# EAGLE design ISS-Notify_Test-Harness (EAGLE 6.4)
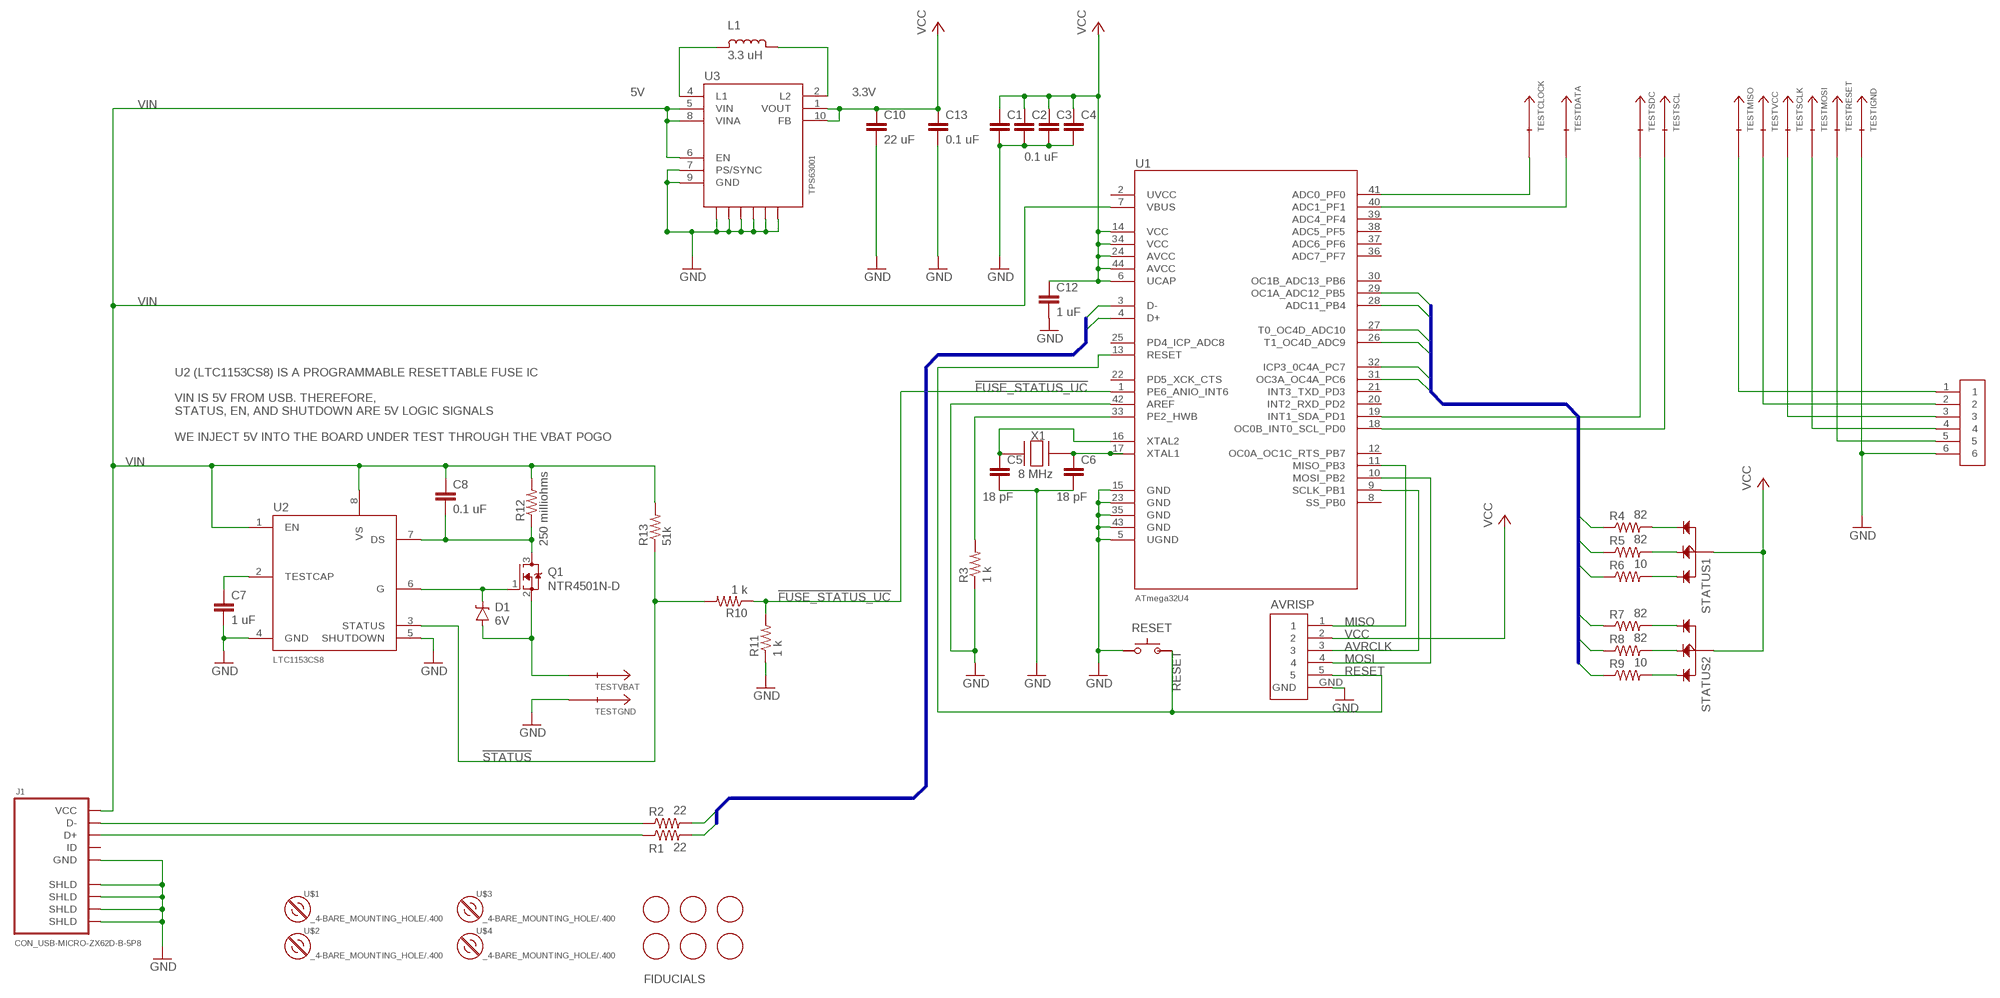
[diagram p0: schematic, sheet 1]

## Parts
AVRISP  AVRISP  [AVRISP]
C1  0.1 uF  C-EU0603-C-NOSILK  [0603-C-NOSILK]
C2  0.1 uF  C-EU0603-C-NOSILK  [0603-C-NOSILK]
C3  0.1 uF  C-EU0603-C-NOSILK  [0603-C-NOSILK]
C4  0.1 uF  C-EU0603-C-NOSILK  [0603-C-NOSILK]
C5  18 pF  C-EU0603-C-NOSILK  [0603-C-NOSILK]
C6  18 pF  C-EU0603-C-NOSILK  [0603-C-NOSILK]
C7  1 uF  C-EU0603-C-NOSILK  [0603-C-NOSILK]
C8  0.1 uF  C-EU0603-C-NOSILK  [0603-C-NOSILK]
C10  22 uF  C-EU0805-C-NOSILK  [0805-C-NOSILK]
C12  1 uF  C-EU0603-C-NOSILK  [0603-C-NOSILK]
C13  0.1 uF  C-EU0603-C-NOSILK  [0603-C-NOSILK]
D1  6V  DIODE-ZENER3.3V  [SOD-323]
F1  FIDUCIAL  [FIDUCIAL_1MM]
F2  FIDUCIAL  [FIDUCIAL_1MM]
F3  FIDUCIAL  [FIDUCIAL_1MM]
F4  FIDUCIAL  [FIDUCIAL_1MM]
F5  FIDUCIAL  [FIDUCIAL_1MM]
F6  FIDUCIAL  [FIDUCIAL_1MM]
J1  CON_USB-MICRO-ZX62D-B-5P8  [USBMICROSMT-HIROSE]
JPROGRAMER  6HEADER  [6HEAD]
L1  3.3 uH  PWR_INDUCTOR  [0805-C-NOSILK]
Q1  NTR4501N-D  [SOT-23]
R1  22  R-US_0603-C-NOSILK  [0603-C-NOSILK]
R2  22  R-US_0603-C-NOSILK  [0603-C-NOSILK]
R3  1 k  R-US_0603-C-NOSILK  [0603-C-NOSILK]
R4  82  R-US_0603-C-NOSILK  [0603-C-NOSILK]
R5  82  R-US_0603-C-NOSILK  [0603-C-NOSILK]
R6  10  R-US_0603-C-NOSILK  [0603-C-NOSILK]
R7  82  R-US_0603-C-NOSILK  [0603-C-NOSILK]
R8  82  R-US_0603-C-NOSILK  [0603-C-NOSILK]
R9  10  R-US_0603-C-NOSILK  [0603-C-NOSILK]
R10  1 k  R-US_0603-C-NOSILK  [0603-C-NOSILK]
R11  1 k  R-US_0603-C-NOSILK  [0603-C-NOSILK]
R12  250 milliohms  R-US_0603-C-NOSILK  [0603-C-NOSILK]
R13  51k  R-US_0603-C-NOSILK  [0603-C-NOSILK]
RESET  SWITCH  [SWITCH]
STATUS1  RGBLED  [SMDRGBLED]
STATUS2  RGBLED  [SMDRGBLED]
TESTCLOCK  POGOPIN  [POGOPIN]
TESTDATA  POGOPIN  [POGOPIN]
TESTGND  POGOPIN  [POGOPIN]
TESTIGND  POGOPIN  [POGOPIN]
TESTMISO  POGOPIN  [POGOPIN]
TESTMOSI  POGOPIN  [POGOPIN]
TESTRESET  POGOPIN  [POGOPIN]
TESTSCL  POGOPIN  [POGOPIN]
TESTSCLK  POGOPIN  [POGOPIN]
TESTSDC  POGOPIN  [POGOPIN]
TESTVBAT  POGOPIN  [POGOPIN]
TESTVCC  POGOPIN  [POGOPIN]
U1  ATMEGA32U4  [TQFP-44]
U2  LTC1153CS8  [SO-8]
U3  TPS63001  [QFN10]
U$1  _4-BARE_MOUNTING_HOLE/.400  [_4/.400-BARE+STD_TOOL_CLEARANCE]
U$2  _4-BARE_MOUNTING_HOLE/.400  [_4/.400-BARE+STD_TOOL_CLEARANCE]
U$3  _4-BARE_MOUNTING_HOLE/.400  [_4/.400-BARE+STD_TOOL_CLEARANCE]
U$4  _4-BARE_MOUNTING_HOLE/.400  [_4/.400-BARE+STD_TOOL_CLEARANCE]
X1  8 MHz  CX5Z  [CX5Z]

## Nets
!FUSE_STATUS_UC: R10.1 R11.2 U1.1(PE6_ANIO_INT6)
!STATUS: R10.2 R13.1 U2.3(STATUS)
AVRCLK: AVRISP.3 U1.9(SCLK_PB1)
D+: R1.2 U1.4(D+)
D-: R2.2 U1.3(D-)
GND: AVRISP.GND C1.2 C2.2 C3.2 C4.2 C5.2 C6.2 C7.2 C10.2 C12.2 C13.2 J1.P5(GND) J1.P$1(SHLD) J1.P$2(SHLD) J1.P$3(SHLD) J1.P$4(SHLD) JPROGRAMER.6 R3.1 R11.1 RESET.3 TESTGND.1(TEST) TESTIGND.1(TEST) U1.5(UGND) U1.15(GND) U1.23(GND) U1.35(GND) U1.42(AREF) U1.43(GND) U2.4(GND) U2.5(SHUTDOWN) U3.3(PGND) U3.7(PS/SYNC) U3.9(GND) U3.PAD(GNDPAD) U3.PGND1 U3.PGND2 U3.PGND3 U3.PGND4
LED1_B: R6.1 U1.29(OC1A_ADC12_PB5)
LED1_G: R5.1 U1.32(ICP3_0C4A_PC7)
LED1_R: R4.1 U1.31(OC3A_OC4A_PC6)
LED2_B: R9.1 U1.26(T1_OC4D_ADC9)
LED2_G: R8.1 U1.28(ADC11_PB4)
LED2_R: R7.1 U1.27(T0_OC4D_ADC10)
LED_CLK: TESTCLOCK.1(TEST) U1.41(ADC0_PF0)
LED_DATA: TESTDATA.1(TEST) U1.40(ADC1_PF1)
MISO: AVRISP.1 U1.11(MISO_PB3)
MOSI: AVRISP.4 U1.10(MOSI_PB2)
N$1: L1.1(A) U3.4(L1)
N$2: L1.2(C) U3.2(L2)
N$3: R4.2 STATUS1.RED(R)
N$4: J1.P3(D+) R1.1
N$5: J1.P2(D-) R2.1
N$6: C5.1 U1.16(XTAL2) X1.1
N$7: R5.2 STATUS1.GREEN(G)
N$8: R6.2 STATUS1.BLUE(B)
N$9: R7.2 STATUS2.RED(R)
N$10: C6.1 U1.17(XTAL1) X1.3
N$11: R8.2 STATUS2.GREEN(G)
N$12: R9.2 STATUS2.BLUE(B)
N$13: C7.1 U2.2(TESTCAP)
N$16: C8.2 Q1.3(D) R12.1 U2.7(DS)
N$18: D1.C Q1.1(G) U2.6(G)
N$19: D1.A Q1.2(S) TESTVBAT.1(TEST)
N$42: R3.2 U1.33(PE2_HWB)
RESET: AVRISP.5 RESET.1 U1.13(RESET)
SCL: TESTSCL.1(TEST) U1.18(OC0B_INT0_SCL_PD0)
SDA: TESTSDC.1(TEST) U1.19(INT1_SDA_PD1)
TESTMISO: JPROGRAMER.1 TESTMISO.1(TEST)
TESTMOSI: JPROGRAMER.4 TESTMOSI.1(TEST)
TESTRESET: JPROGRAMER.5 TESTRESET.1(TEST)
TESTSCLK: JPROGRAMER.3 TESTSCLK.1(TEST)
TESTVCC: JPROGRAMER.2 TESTVCC.1(TEST)
VCC: AVRISP.2 C1.1 C2.1 C3.1 C4.1 C10.1 C12.1 C13.1 STATUS1.ANODE STATUS2.ANODE U1.6(UCAP) U1.14(VCC) U1.24(AVCC) U1.34(VCC) U1.44(AVCC) U3.1(VOUT) U3.10(FB)
VIN: C8.1 J1.P1(VCC) R12.2 R13.2 U1.7(VBUS) U2.1(EN) U2.8(VS) U3.5(VIN) U3.6(EN) U3.8(VINA)
Unconnected: J1.P4(ID) U1.8(SS_PB0) U1.12(OC0A_OC1C_RTS_PB7) U1.20(INT2_RXD_PD2) U1.21(INT3_TXD_PD3) U1.22(PD5_XCK_CTS) U1.25(PD4_ICP_ADC8) U1.30(OC1B_ADC13_PB6) U1.36(ADC7_PF7) U1.37(ADC6_PF6) U1.38(ADC5_PF5) U1.39(ADC4_PF4)

## Buses
D+,D-
LED1_R,LED1_G,LED1_B,LED2_R,LED2_G,LED2_B

## Notes on the sheet
- 5V | 3.3V
- U2 (LTC1153CS8) IS A PROGRAMMABLE RESETTABLE FUSE IC
  
  VIN IS 5V FROM USB. THEREFORE, 
  STATUS, EN, AND SHUTDOWN ARE 5V LOGIC SIGNALS
  
  WE INJECT 5V INTO THE BOARD UNDER TEST THROUGH THE VBAT POGO
- FIDUCIALS

## Power pins joined to a net without a drawn wire
UVCC: U1.2(UVCC)

## Library data of the parts
AVRISP = ISS-Notify:AVRISP: ISP header for AVR
C1-C8 C10 C12 C13 = rcl_custom:C-EU: CAPACITOR, European symbol
D1 = SparkFun-DiscreteSemi:DIODE-ZENER: Zener Diode Production Part - 8199 3.4V Zener Voltage; PROD_ID: DIO-11284; VALUE: 3.3V
F1-F6 = ISS-Notify:FIDUCIAL
J1 = ISS-Notify:CON_USB-MICRO-ZX62D-B-5P8
JPROGRAMER = ISS-Notify:6HEADER
L1 = ISS-Notify:PWR_INDUCTOR: 3.3 uH Inductor AIML-0805-3R3K-T
Q1 = max-viz:NTR4501N-D
R1-R13 = rcl_custom:R-US_: RESISTOR, American symbol
RESET = ISS-Notify:SWITCH: Tall micro push button
STATUS1 STATUS2 = ISS-Notify:RGBLED
TESTCLOCK TESTDATA TESTGND TESTIGND TESTMISO TESTMOSI TESTRESET TESTSCL TESTSCLK TESTSDC TESTVBAT TESTVCC = ISS-Notify:POGOPIN
U1 = ISS-Notify:ATMEGA32U4: ATMega32U4 AVR embedded microcontroller with USB, UART, SPI, I2C, 32K program space, 1K eeprom, 2.5 K sram
U2 = ISS-Notify:LTC1153CS8
U3 = ISS-Notify:TPS63001: High efficiency buck boost SPS
U$1-U$4 = ISS-Notify:_4-BARE_MOUNTING_HOLE: 1/8" drill hole for #4 screw mount
X1 = ISS-Notify:CX5Z: 8 MHz Crystal

## Board
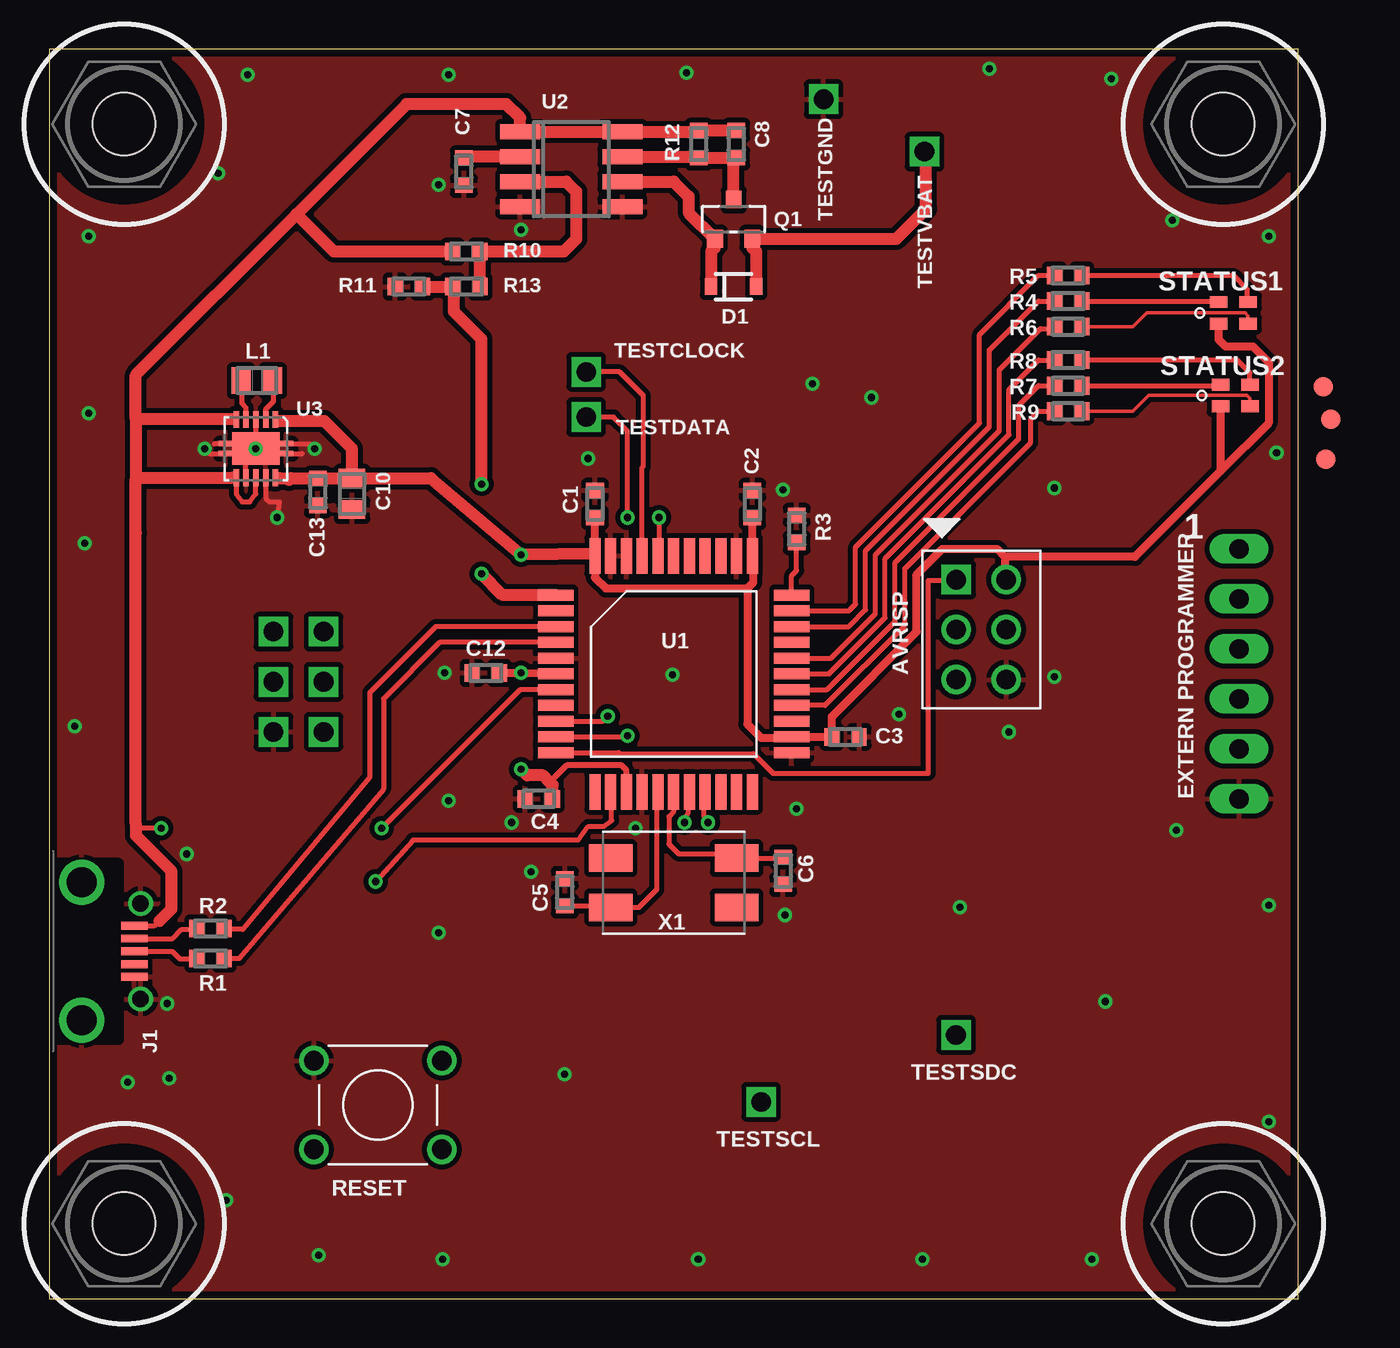
[diagram p1: board, top side]
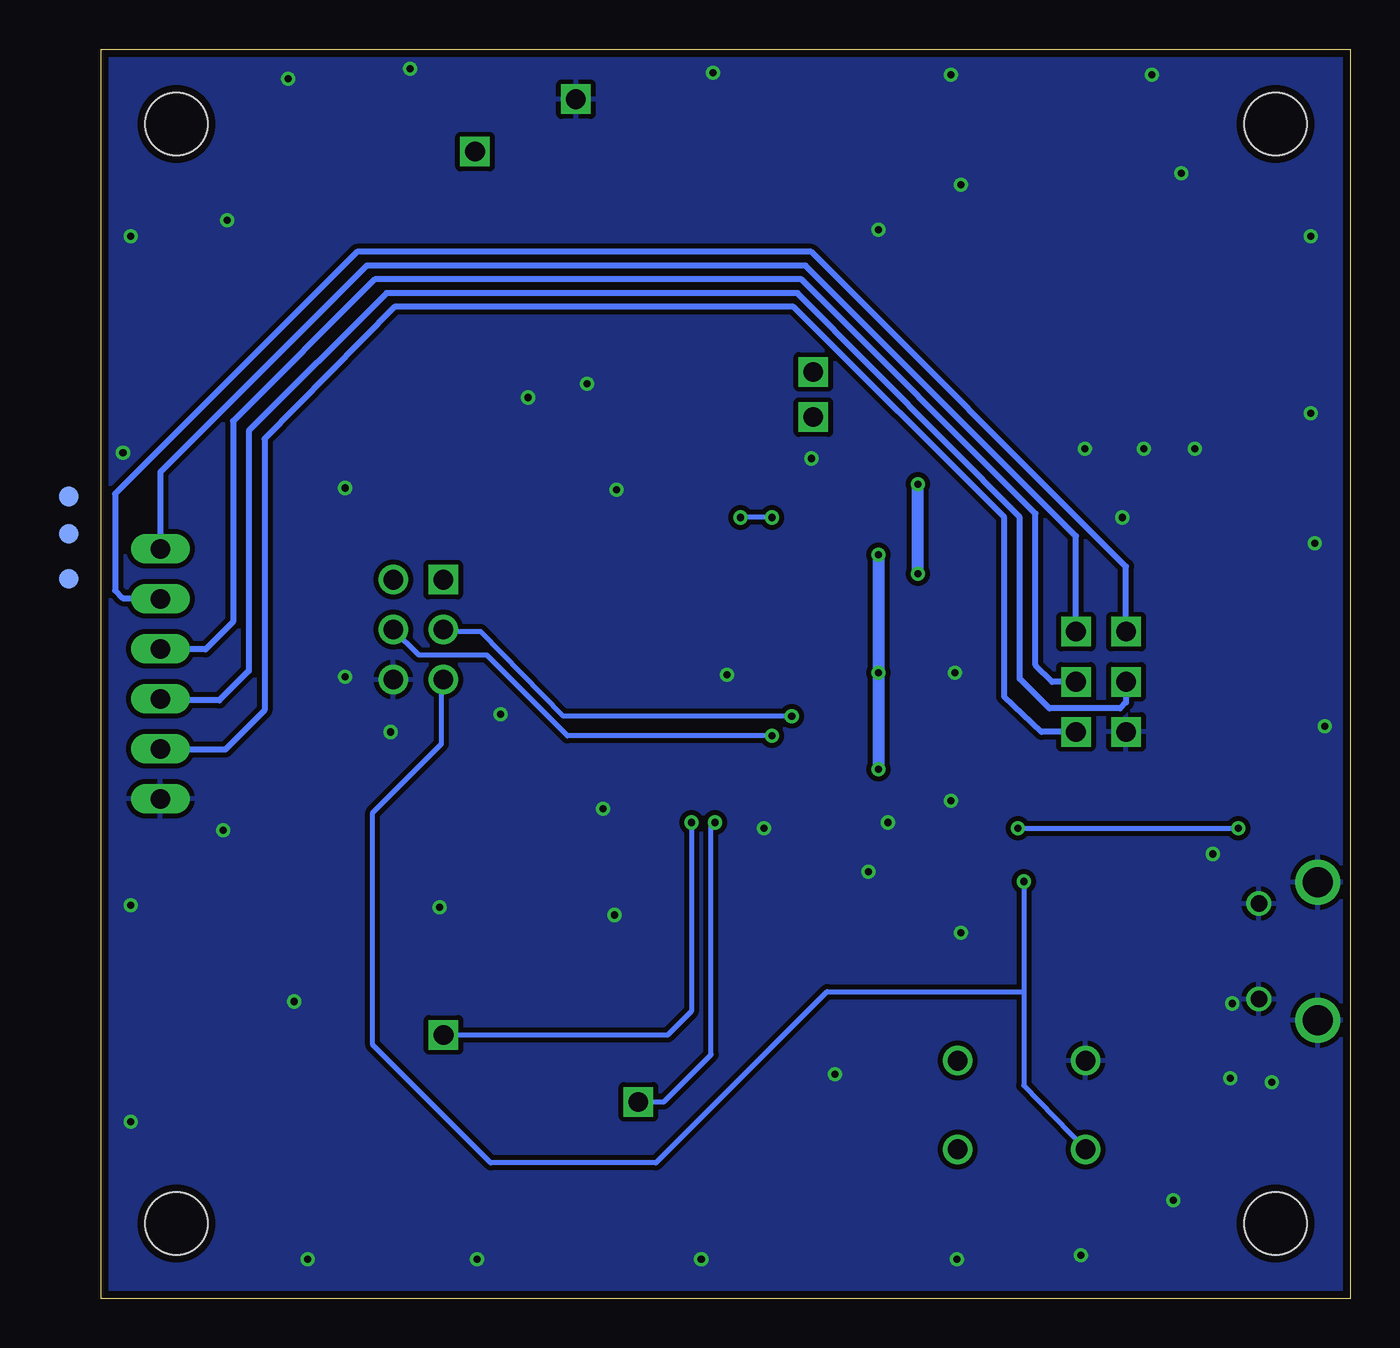
[diagram p2: board, bottom side, seen from below]

Size 63.5 x 63.5 mm. Coordinates in mm from the lower left corner, seen from the top.
Outline: 0,0 63.5,0 63.5,63.5 0,63.5 0,0
Copper layers (1*16): Top 0.0356mm / dielectric 1.5011mm / Bottom 0.0356mm
Design rules "LaenPCBOrder": minimum track width 6mil, minimum drill 13mil, track to track 6mil, track to pad 6mil, pad to pad 6mil, via to via 6mil, smd to smd 6mil, copper to edge 15mil, drill to drill 6mil, minimum pad ring 7mil, minimum via ring 7mil, stop-mask expansion 4mil, vias tented up to drill 0mil, thermal gap 10mil

### Footprints (pad centres in the part's own frame; a part is rotated, then mirrored left to right if it is on the bottom)
AVRISP = drill 1 square: 1 -1.27,2.54 | drill 1: 2 1.27,2.54; 3 -1.27,0; 4 1.27,0; 5 -1.27,-2.54; GND 1.27,-2.54
0603-C-NOSILK = smd 0.75 x 0.9: 1 -0.7,0; 2 0.7,0
0805-C-NOSILK = smd 0.95 x 1.35: 1 -0.8,0; 2 0.8,0
SOD-323 = smd 0.63 x 0.83: A 1.15,0; C -1.15,0
FIDUCIAL_1MM = smd 1 x 1: 1 0,0
USBMICROSMT-HIROSE = smd 0.4 x 1.35: P1 -1.046,2.675; P2 -0.396,2.675; P3 0.254,2.675; P4 0.904,2.675; P5 1.554,2.675 | drill 1.524: P$1 3.764,0; P$2 -3.256,0 | drill 0.838: P$3 -2.171,3; P$4 2.679,3
6HEAD = drill 1 long: 1 0,6.35; 2 0,3.81; 3 0,1.27; 4 0,-1.27; 5 0,-3.81; 6 0,-6.35
SOT-23 = smd 0.8 x 0.9: 1 -0.95,-1; 2 0.95,-1; 3 0,1
SWITCH = drill 1: 1 -3.25,-2.25; 2 3.25,-2.25; 3 -3.25,2.25; 4 3.25,2.25
SMDRGBLED = smd 0.9 x 0.6: ANODE -0.75,-0.55; BLUE 0.75,-0.55; GREEN 0.75,0.55; RED -0.75,0.55
POGOPIN = drill 1 square: 1 0,0
TQFP-44 = smd 1.8 x 0.56: 1 -6,4; 2 -6,3.2; 3 -6,2.4; 4 -6,1.6; 5 -6,0.8; 6 -6,0; 7 -6,-0.8; 8 -6,-1.6; 9 -6,-2.4; 10 -6,-3.2; 11 -6,-4; 23 6,-4; 24 6,-3.2; 25 6,-2.4; 26 6,-1.6; 27 6,-0.8; 28 6,0; 29 6,0.8; 30 6,1.6; 31 6,2.4; 32 6,3.2; 33 6,4 | smd 0.56 x 1.8: 12 -4,-6; 13 -3.2,-6; 14 -2.4,-6; 15 -1.6,-6; 16 -0.8,-6; 17 0,-6; 18 0.8,-6; 19 1.6,-6; 20 2.4,-6; 21 3.2,-6; 22 4,-6; 34 4,6; 35 3.2,6; 36 2.4,6; 37 1.6,6; 38 0.8,6; 39 0,6; 40 -0.8,6; 41 -1.6,6; 42 -2.4,6; 43 -3.2,6; 44 -4,6
SO-8 = smd 0.762 x 2.032: 1 -1.905,-2.727; 2 -0.635,-2.727; 3 0.635,-2.727; 4 1.905,-2.727; 5 1.905,2.473; 6 0.635,2.473; 7 -0.635,2.473; 8 -1.905,2.473
QFN10 = smd 0.28 x 0.85: 1 -1,-1.475; 2 -0.5,-1.475; 3 0,-1.475; 4 0.5,-1.475; 5 1,-1.475; 6 1,1.475; 7 0.5,1.475; 8 0,1.475; 9 -0.5,1.475; 10 -1,1.475 | smd 2.4 x 1.65: PAD 0,0 | smd 0.7 x 0.28: PGND1 1.55,0.25; PGND2 -1.55,0.25; PGND3 -1.55,-0.25; PGND4 1.55,-0.25
_4/.400-BARE+STD_TOOL_CLEARANCE = hole 3.175: 0,0
CX5Z = smd 2.2 x 1.4: 1 -3.2,-1.25; 2 3.2,-1.25; 3 3.2,1.25; 4 -3.2,1.25

### Placement (x,y rotation side)
AVRISP  47.38,34 0 top
C1  27.75,40.39 90 top
C2  35.75,40.39 90 top
C3  40.49,28.55 0 top
C4  24.89,25.4 180 top
C5  26.22,20.66 90 top
C6  37.32,21.74 270 top
C7  21.08,57.28 270 top
C8  34.92,58.67 270 top
C10  15.4,40.9 270 top
C12  22.2,31.8 180 top
C13  13.66,41 270 top
D1  34.8,51.44 0 top
F1  64.77,46.35 0 top
F2  65.15,44.7 0 top
F3  64.9,42.67 0 top
F4  65.15,40.77 0 bottom
F5  65.15,38.86 0 bottom
F6  65.15,36.58 0 bottom
J1  1.65,17.91 270 top
JPROGRAMER  60.5,31.75 0 top
L1  10.56,46.66 0 top
Q1  34.8,54.86 0 top
R1  8.2,17.29 0 top
R2  8.2,18.82 0 top
R3  38,39.12 270 top
R4  51.8,50.7 0 top
R5  51.8,52 0 top
R6  51.8,49.4 0 top
R7  51.8,46.4 0 top
R8  51.8,47.7 0 top
R9  51.8,45.1 0 top
R10  21.21,51.44 0 top
R11  18.29,51.44 0 top
R12  33.02,58.67 90 top
R13  21.21,53.21 180 top
RESET  16.71,9.84 0 top
STATUS1  60.2,50.1 0 top
STATUS2  60.3,45.9 0 top
TESTCLOCK  27.3,47.1 0 top
TESTDATA  27.3,44.8 0 top
TESTGND  39.37,60.96 0 top
TESTIGND  11.4,28.8 0 top
TESTMISO  13.95,33.9 0 top
TESTMOSI  11.4,31.35 0 top
TESTRESET  13.95,28.8 0 top
TESTSCL  36.2,10 0 top
TESTSCLK  13.95,31.35 0 top
TESTSDC  46.1,13.4 0 top
TESTVBAT  44.5,58.3 0 top
TESTVCC  11.4,33.9 0 top
U1  31.75,31.75 0 top
U2  26.67,57.4 270 top
U3  10.51,43.2 180 top
U$1  3.81,59.69 0 top
U$2  59.69,59.69 0 top
U$3  59.69,3.81 0 top
U$4  3.81,3.81 0 top
X1  31.75,21.14 0 top

### Tracks (layer width: path | path; a pad name or v marks a point on that pad's centre or on a via)
!FUSE_STATUS_UC  (via drill 0.36 pad 0.71)
  Top 0.61: R11.2 R10.1 20.57,51.37 20.57,50.16 21.97,48.77 v21.97,41.4 | U1.1 23.05,35.75 v21.97,36.83
  Bottom 0.61: v21.97,36.83 v21.97,41.4
!STATUS
  Top 0.61: U2.3 26.29,56.77 26.8,56.26 26.8,53.85 26.16,53.21 R13.1 R10.2
AVRCLK  (via drill 0.36)
  Top 0.254: 25.7,29.4 U1.9 28.15,29.35 v28.4,29.6
  Bottom 0.254: v28.4,29.6 40,29.6 44.2,33.9 46.01,33.9 AVRISP.3
D+
  Top 0.254: R1.2 9.66,17.29 17,25.9 17,30.5 19.85,33.35 U1.4
D-
  Top 0.254: 8.84,18.87 R2.2 8.94,18.77 9.84,18.77 16.3,26.5 16.3,30.8 19.65,34.15 U1.3
GND  (via drill 0.36)
  Top 0.254: 8.92,43.44 8.39,43.44 | 12.04,43.44 13.26,43.44 v13.5,43.2 | 12.11,42.95 12.87,42.95 | U3.3 U3.PAD 10.4,43.2 10,42.8 U3.7 | v7.9,43.2 8.15,42.95 U3.PGND1 | U3.9 11.01,40.69 11.2,40.5 11.7,40.5 v11.6,39.7
  Top 0.33: U3.PGND4 8.92,43.45 8.92,43.44 | 12.04,43.44 U3.PGND3
  other vias: 6,15 4,11 13.7,2.2 20,2 33,2 53,2 44.4,2 37.4,19.5 24.5,21.7 23.5,24.2 31.7,31.7 38,24.9 27.4,42.7 37.3,41.1 7,22.6 6.1,11.2 57.1,54.8 10.5,43.2 2,45 2,54 54,62 62,54 62.4,43 57.3,23.8 62,20 62,9 9,5 1.8,38.4 1.3,29.1 8.6,57.2 10.1,62.2 20.3,62.2 32.4,62.3 47.8,62.5 20.1,31.8 20.3,25.3 26.2,11.4 46.3,19.9 41.8,45.8 51.1,31.6 48.8,28.8 38.8,46.5 29.8,23.9 43.2,29.7 51.1,41.2 53.7,15.1 19.8,18.6 23.98,54.33 19.79,56.61
  pour Top (isolate 0.254): 0,0 0,63.5 63.5,63.5 63.5,0
  pour Bottom (isolate 0.254): 0,0 0,63.5 63.5,63.5 63.5,0
LED1_B
  Top 0.254: U1.29 39.75,32.55 42,34.8 42,37.8 48.3,44.1 48.3,47.2 50.4,49.3 51,49.3 R6.1
LED1_G
  Top 0.254: U1.32 40.65,34.95 41,35.3 41,38.2 47.3,44.5 47.3,49 50.3,52 R5.1
LED1_R
  Top 0.254: U1.31 40.65,34.15 41.5,35 41.5,38 47.8,44.3 47.8,48.2 50.3,50.7 R4.1
LED2_B
  Top 0.254: R9.1 50.3,45.1 49.9,44.7 49.9,43.5 43.5,37.1 43.5,34.2 39.45,30.15 U1.26
LED2_G
  Top 0.254: U1.28 39.65,31.75 42.5,34.6 42.5,37.6 48.8,43.9 48.8,46.2 50.3,47.7 R8.1
LED2_R
  Top 0.254: R7.1 50.3,46.4 49.3,45.4 49.3,43.7 43,37.4 43,34.4 39.55,30.95 U1.27
LED_CLK
  Top 0.254: U1.41 30.15,42.25 30.2,42.3 30.2,45.9 29,47.1 TESTCLOCK.1
LED_DATA  (via drill 0.36)
  Top 0.254: v31,39.7 31,37.8 | v29.4,39.7 29.4,44.1 28.7,44.8 TESTDATA.1
  Top 0.305: 31,37.8 U1.40
  Bottom 0.254: v29.4,39.7 v31,39.7
MISO
  Top 0.254: U1.11 28.95,27.75 29,27.7 35.8,27.7 36.8,26.7 44.7,26.7 44.7,36.5 46.07,36.5 AVRISP.1
MOSI  (via drill 0.36)
  Top 0.254: U1.10 29.35,28.55 v29.4,28.6
  Bottom 0.254: v29.4,28.6 39.8,28.6 43.9,32.7 47.35,32.7 AVRISP.4
N$1
  Top 0.254: U3.4 10.01,45.29 9.8,45.5 9.8,46.72 L1.1
N$2
  Top 0.254: U3.2 11.01,45.21 11.4,45.6 11.4,46.72 L1.2
N$3
  Top 0.254: R4.2 59.4,50.7 STATUS1.RED
N$4
  Top 0.254: R1.1 7.48,17.27 6.64,17.27 6.26,17.65 J1.P3
N$5
  Top 0.254: R2.1 7.46,18.77 6.74,18.77 6.27,18.3 J1.P2
N$6
  Top 0.254: C5.1 28.38,19.96 X1.1 29.99,19.89 30.9,20.8 30.9,25.7 U1.16
N$7
  Top 0.254: R5.2 60.2,52 60.9,51.3 60.9,50.7 STATUS1.GREEN
N$8
  Top 0.178: STATUS1.BLUE 60.95,49.95 60.8,50.1 55.8,50.1 55.1,49.4 R6.2
N$9
  Top 0.254: R7.2 59.5,46.4 STATUS2.RED
N$10
  Top 0.254: U1.17 31.75,24.75 31.5,24.5 31.5,23.1 32,22.6 34.94,22.6 X1.3 37.27,22.39 C6.1
N$11
  Top 0.254: STATUS2.GREEN 61.05,47.05 60.4,47.7 R8.2
N$12
  Top 0.178: STATUS2.BLUE 61.05,45.75 60.9,45.9 55.9,45.9 55.1,45.1 R9.2
N$13
  Top 0.61: U2.2 21.14,58.04 C7.1
N$16
  Top 0.61: U2.7 32.95,58.04 R12.1 C8.2 34.8,57.85 Q1.3
N$18
  Top 0.61: U2.6 31.75,56.77 32.51,56.01 32.51,55.2 Q1.1 33.85,53.41 33.66,53.21 D1.C
N$19
  Top 0.61: D1.A 35.94,53.21 35.75,53.41 Q1.2 43.07,53.86 44.58,55.37 44.58,58.22 TESTVBAT.1
N$42
  Top 0.254: U1.33 37.75,36.75 38,37 R3.2
RESET  (via drill 0.36)
  Top 0.254: U1.13 28.6,25.7 28.6,24.3 28.2,24 27.4,24 26.9,23.3 18.5,23.3 v16.6,21.2
  Bottom 0.254: v16.6,21.2 16.6,15.6 | 16.6,15.6 16.6,10.83 RESET.1 | 16.6,15.6 26.6,15.6 35.3,6.9 43.7,6.9 49.7,12.9 49.7,24.7 46.2,28.2 46.2,31.37 AVRISP.5
SCL  (via drill 0.36)
  Top 0.254: v32.3,24.2 32.3,24.4 32.5,24.7 32.5,25.7 U1.18
  Bottom 0.254: v32.3,24.2 32.5,24 32.5,12.4 34.9,10 TESTSCL.1
SDA  (via drill 0.36)
  Top 0.254: v33.5,24.2 33.5,24.3 33.3,24.5 33.3,25.7 U1.19
  Bottom 0.254: v33.5,24.2 33.5,14.6 34.7,13.4 TESTSDC.1
TESTMISO
  Bottom 0.305: TESTMISO.1 13.95,38.75 27.7,52.5 50,52.5 60.5,42 JPROGRAMER.1
TESTMOSI
  Bottom 0.305: TESTMOSI.1 11.4,30.3 11.7,30 15.3,30 16.8,31.5 16.8,39.7 28.1,51.1 49,51.1 56,44.1 56,31.9 57.5,30.4 60.42,30.4 JPROGRAMER.4
TESTRESET
  Bottom 0.305: TESTRESET.1 15.7,28.8 17.6,30.6 17.6,39.7 28.3,50.4 48.6,50.4 55.2,43.7 55.2,29.9 57.2,27.9 60.46,27.9 JPROGRAMER.5
TESTSCLK
  Bottom 0.305: TESTSCLK.1 15.15,31.35 16,32.2 16,39.9 27.9,51.8 49.6,51.8 56.8,44.6 56.8,34.4 58.2,33 60.48,33 JPROGRAMER.3
TESTVCC
  Bottom 0.305: TESTVCC.1 11.4,37.2 27.4,53.2 50.5,53.2 62.8,40.9 62.8,36 62.4,35.6 60.54,35.6 JPROGRAMER.2
VCC  (via drill 0.36)
  Top 0.254: U3.10 11.68,41.73 11.7,41.7 | v24,31.8 v23.99,31.8 v24,31.81
  Top 0.305: U3.1 11.57,44.67 11.65,44.6 | U1.14 29.35,26.85 29.1,27.1 26.3,27.1 25.45,26.25
  Top 0.406: 27.75,37.85 C1.1 | C2.1 U1.34 35.8,37.7 35.8,36.4 35.5,36.1 | C12.1 v24,31.81 U1.6 | U1.44 27.75,36.65 28.3,36.1 35.5,36.1 | 35.5,36.1 35.5,29.2 36.2,28.5 37.7,28.5 U1.24 C3.1 39.79,29.59 44.1,33.9 44.1,36.8 45.4,38.1 48.2,38.1 48.6,37.7 | 48.6,37.7 48.6,36.59 AVRISP.2 | STATUS2.ANODE 59.55,42.05 | 59.55,42.05 55.2,37.7 48.6,37.7 | STATUS1.ANODE 59.45,48.75 59.8,48.4 61.2,48.4 62,47.6 62,44.5 59.55,42.05
  Top 0.61: C10.1 15.4,43.2 14,44.6 11.65,44.6 | 11.7,41.7 12.3,41.7 | 12.3,41.7 C13.1 C10.1 | 12.2,41.6 12.3,41.7 | U1.44 27.75,37.85 v24,37.8 19.4,41.7 C10.1 | C4.1 25.59,26.11 25.45,26.25 25.1,26.6 24.3,26.6 v24,26.9
  Bottom 0.61: v24,37.8 v24,31.8 v24,26.9
VIN  (via drill 0.36)
  Top 0.254: U3.5 9.32,44.67 9.3,44.7 | 4.4,38.64 4.4,38.9 | U1.7 23.95,30.95 v16.9,23.9 | v5.7,23.9 4.6,23.9 4.4,24.1 | U3.8 10.5,41.72 10.5,40.9 10.2,40.5 9.8,40.5 9.51,40.89 U3.6 9.34,41.73 | J1.P1 5.36,18.95 5.61,19.2
  Top 0.61: 5.61,19.2 6.22,19.81 6.22,21.72 4.4,23.54 4.4,24.1 4.4,38.9 4.4,41.67 4.46,41.73 | 12.57,55.12 18.16,60.71 23.24,60.71 23.94,60 U2.1 U2.8 32.95,59.31 R12.2 C8.1 | 12.57,55.12 4.4,46.95 4.4,44.7 | 9.3,44.7 4.4,44.7 | 4.46,41.73 9.34,41.73 | 4.4,44.7 4.4,41.78 4.46,41.73 | R13.2 14.48,53.21 12.57,55.12
  Bottom 0.254: v16.9,23.9 v5.7,23.9

### Text on the board
tNames: EXTERN PROGRAMMER